# EAGLE design BLEduino_Shield-Shield (EAGLE 6.5.0)
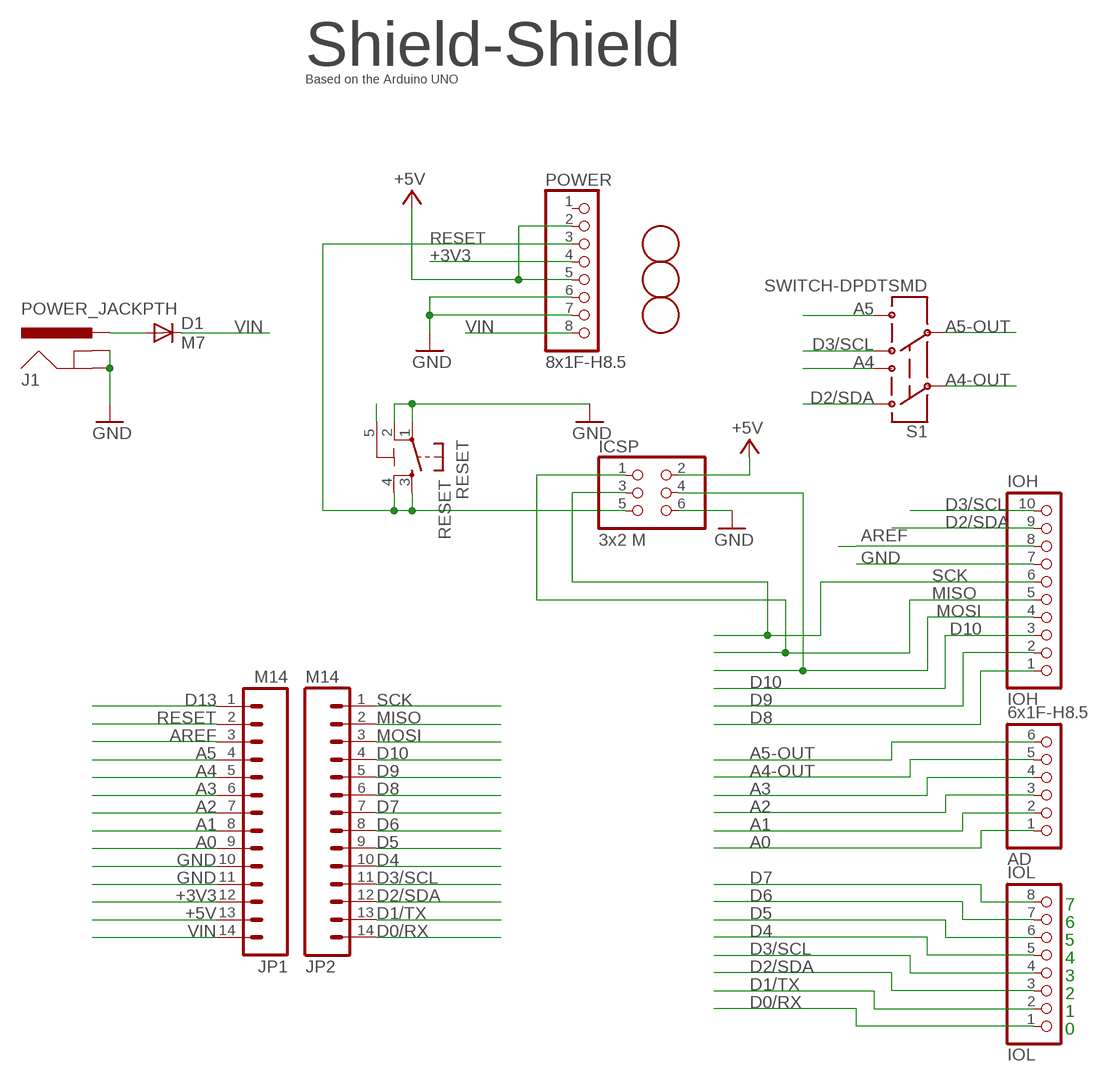
[diagram p0: schematic, sheet 1]

## Parts
AD  6x1F-H8.5  PINHD-1X6  [1X06]
D1  M7  DIODE-SMB  [SMB]
FD1  FIDUCIALMOUNT  [FIDUCIA-MOUNT]
FD2  FIDUCIALMOUNT  [FIDUCIA-MOUNT]
FD3  FIDUCIALMOUNT  [FIDUCIA-MOUNT]
ICSP  3x2 M  PINHD-2X3  [2X03]
IOH  IOH  PINHD-1X10_ARD  [1X10]
IOL  IOL  PINHD-1X8  [1X08]
J1  POWER_JACKPTH  [POWER_JACK_PTH]
JP1  M14  [1X14]
JP2  M14  [1X14]
POWER  8x1F-H8.5  PINHD-1X8  [1X08]
RESET  RESET  TS42  [TS42]
S1  SWITCH-DPDTSMD  [AYZ0202]

## Nets
+3V3: JP1.12 POWER.4
+5V: ICSP.2 JP1.13 POWER.2 POWER.5
A0: AD.1 JP1.9
A1: AD.2 JP1.8
A2: AD.3 JP1.7
A3: AD.4 JP1.6
A4: JP1.5 S1.3
A4-OUT: AD.5 S1.2
A5: JP1.4 S1.6
A5-OUT: AD.6 S1.5
AREF: IOH.8 JP1.3
D0/RX: IOL.1 JP2.14
D1/TX: IOL.2 JP2.13
D2/SDA: IOH.9 IOL.3 JP2.12 S1.1
D3/SCL: IOH.10 IOL.4 JP2.11 S1.4
D4: IOL.5 JP2.10
D5: IOL.6 JP2.9
D6: IOL.7 JP2.8
D7: IOL.8 JP2.7
D8: IOH.1 JP2.6
D9: IOH.2 JP2.5
D10: IOH.3 JP2.4
D13: JP1.1
GND: ICSP.6 IOH.7 J1.GND J1.GNDBREAK JP1.10 JP1.11 POWER.6 POWER.7 RESET.1 RESET.2
MISO: ICSP.1 IOH.5 JP2.2
MOSI: ICSP.4 IOH.4 JP2.3
N$2: RESET.5(5-GND)
N$3: D1.A J1.PWR
RESET: ICSP.5 JP1.2 POWER.3 RESET.3 RESET.4
SCK: ICSP.3 IOH.6 JP2.1
VIN [power]: D1.C JP1.14 POWER.8
Unconnected: POWER.1

## Notes on the sheet
- Shield-Shield
- Based on the Arduino UNO
- 7
- 6
- 5
- 4
- 3
- 2
- 1
- 0

## Library data of the parts
AD = SmartPrj:PINHD-1X6: PIN HEADER
D1 = diode:DIODE-: DIODE
FD1-FD3 = SmartPrj:FIDUCIALMOUNT
ICSP = SmartPrj:PINHD-2X3: PIN HEADER
IOH = SmartPrj:PINHD-1X10_ARD: PIN HEADER
IOL POWER = SmartPrj:PINHD-1X8: PIN HEADER
J1 = SparkFun:POWER_JACK: Power Jack This is the standard 5.5mm barrel jack for power. The PTH is the most common, proven, reliable, footprint. All others are experimental. The Slot footprint only works if the mill layer is transmitted to the PCB fab house so be warned. Spark Fun Electronics SKU : PRT-00119. Mating wall wart : TOL-00298 (and others)
JP1 JP2 = SparkFun:M14: Header 14 Standard 14-pin 0.1" header. Use with straight break away headers (SKU : PRT-00116), right angle break away headers (PRT-00553), swiss pins (PRT-00743), machine pins (PRT-00117), and female headers (PRT-00115).
RESET = SmartPrj:TS42: TS42 Dongnan Electronics Tact switch VDC 12V - 50mA
S1 = SparkFun:SWITCH-DPDT: DPDT Version of the COM-00597

## Net classes
0 default: width 0.254 mm, clearance 0.254 mm
1 power: width 0.61 mm, drill 0.61 mm, clearance 0.254 mm
2 gnd: width 0.305 mm, drill 0.559 mm, clearance 0.254 mm
3 usbvcc: width 0.508 mm, drill 0.61 mm, clearance 0.254 mm
4 aref: width 0.406 mm, drill 0.61 mm, clearance 0.254 mm

## Board
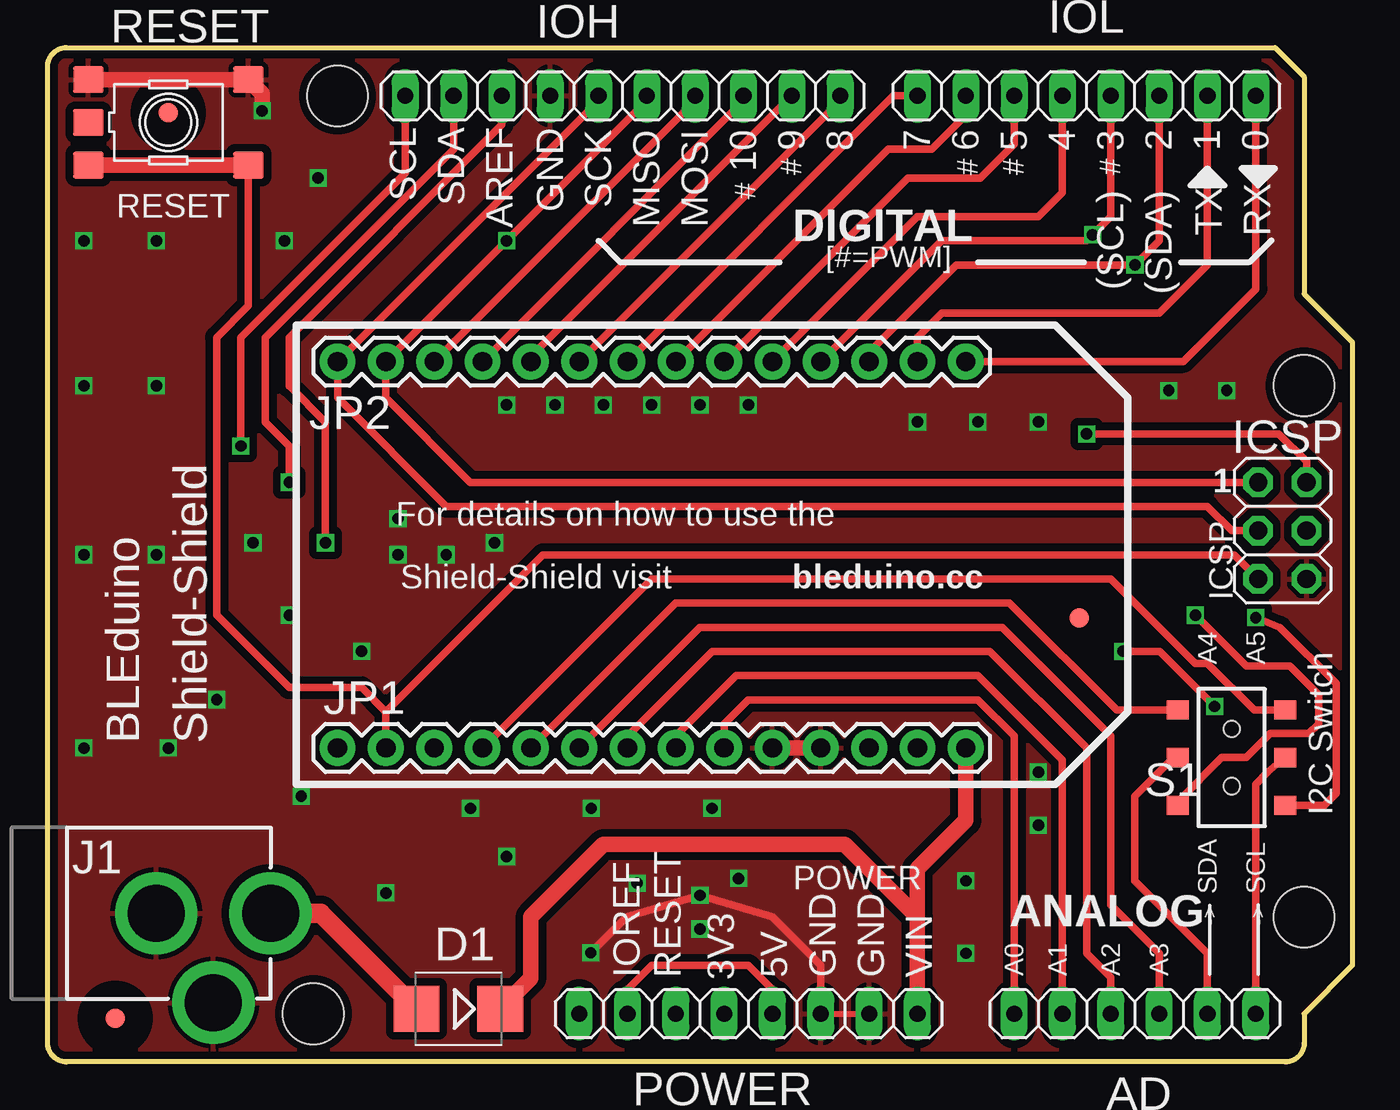
[diagram p1: board, top side]
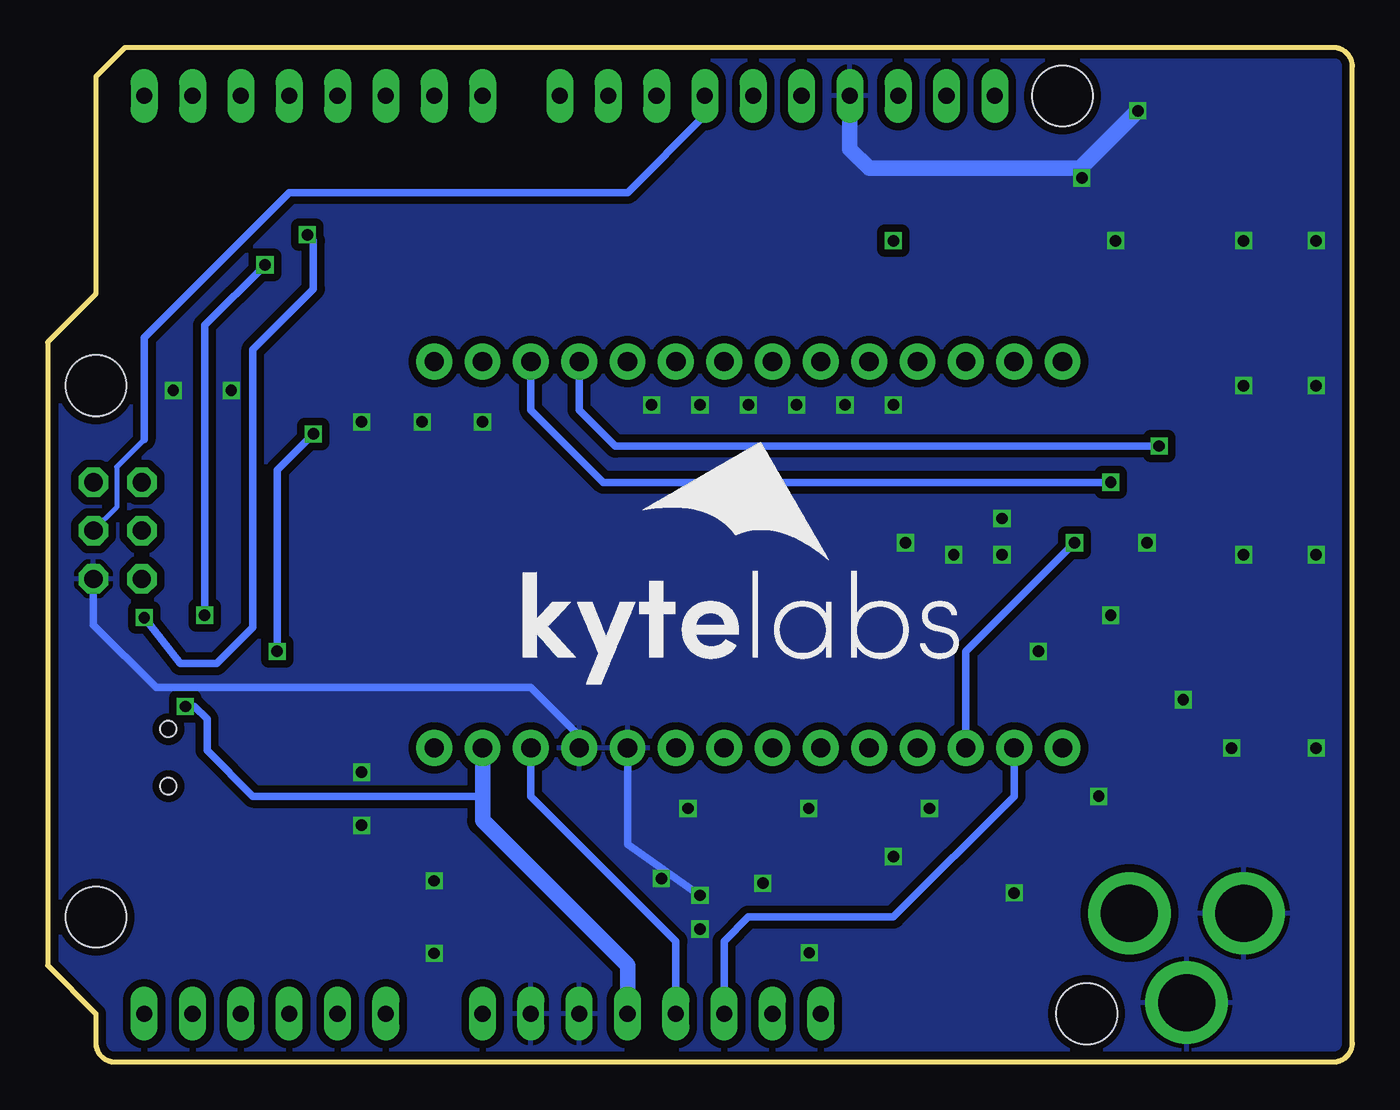
[diagram p2: board, bottom side, seen from below]

Size 68.58 x 53.34 mm. Coordinates in mm from the lower left corner, seen from the top.
Outline: 64.52,53.34 66.04,51.82 66.04,40.39 68.58,37.85 68.58,5.08 66.04,2.54 66.04,1 arc-90 65.04,0 1,0 arc-90 0,1 0,52.34 arc-90 1,53.34 64.52,53.34
Copper layers (1*2*15*16): Top 0.035mm / dielectric 0.2mm / Route2 0.0175mm / dielectric 1.1mm / Route15 0.0175mm / dielectric 0.2mm / Bottom 0.035mm
Design rules "SeeedStudio_DRU_no_angle_20130527": minimum track width 6mil, minimum drill 12mil, track to track 6mil, track to pad 6mil, pad to pad 6mil, via to via 6mil, smd to smd 0mil, copper to edge 10mil, drill to drill 10mil, minimum pad ring 6mil, minimum via ring 6mil, stop-mask expansion 2mil, vias tented up to drill 25mil, thermal gap 10mil
Holes 3.2 mm at 66.04,35.56 66.04,7.62 15.24,50.8 13.97,2.54
vRestrict: area 22.9,44.1 to 24.6,49.1; area 25.4,45.5 to 27.1,49.1; area 28.4,45.3 to 29.6,48.8; area 31,45.3 to 32.1,48.8; area 33.5,45.3 to 34.7,48.8; area 36.1,45.3 to 37.2,48.8; area 38.7,47.2 to 39.9,48.8; area 40.3,45.1 to 47.6,46.9; area 60.3,44.2 to 61.7,46.7; area 62.9,44.2 to 64.3,46.7; area 61.3,35.8 to 64.8,37.2; area 0.6,21.8 to 2,30.1; 14 more areas

### Footprints (pad centres in the part's own frame; a part is rotated, then mirrored left to right if it is on the bottom)
1X06 = drill 0.85 pad 1.422 long: 1 -6.35,0; 2 -3.81,0; 3 -1.27,0; 4 1.27,0; 5 3.81,0; 6 6.35,0
SMB = smd 2.4 x 2.4: A 2.2,0; C -2.2,0
FIDUCIA-MOUNT = smd 1.016 x 1.016: P$1 0,0
2X03 = drill 0.95 pad 1.55 octagon: 1 -2.54,-1.27; 2 -2.54,1.27; 3 0,-1.27; 4 0,1.27; 5 2.54,-1.27; 6 2.54,1.27
1X10@1 = drill 0.85 pad 1.422 long: 1 -11.43,0; 2 -8.89,0; 3 -6.35,0; 4 -3.81,0; 5 -1.27,0; 6 1.27,0; 7 3.81,0; 8 6.35,0; 9 8.89,0; 10 11.43,0
1X08 = drill 0.85 pad 1.422 long: 1 -8.89,0; 2 -6.35,0; 3 -3.81,0; 4 -1.27,0; 5 1.27,0; 6 3.81,0; 7 6.35,0; 8 8.89,0
POWER_JACK_PTH = drill 2.997 pad 4.318: GND 0,7.7; GNDBREAK 4.7,10.7; PWR 0,13.7
1X14 = drill 1.016 pad 1.88: 1 0,0; 2 2.54,0; 3 5.08,0; 4 7.62,0; 5 10.16,0; 6 12.7,0; 7 15.24,0; 8 17.78,0; 9 20.32,0; 10 22.86,0; 11 25.4,0; 12 27.94,0; 13 30.48,0; 14 33.02,0
TS42 = smd 1.6 x 1.4: 1 -4.2,2.25; 2 4.2,2.25; 3 -4.2,-2.25; 4 4.2,-2.25; 5 -4.2,0
AYZ0202 = smd 1 x 1.15: 1 -2.5,2.825; 2 0,2.825; 3 2.5,2.825; 4 -2.5,-2.825; 5 0,-2.825; 6 2.5,-2.825 | hole 0.85: 1.5,0; -1.5,0

### Placement (x,y rotation side)
AD  57.15,2.54 0 top
D1  21.59,2.79 180 top
FD1  6.35,49.91 0 top
FD2  54.22,23.34 0 top
FD3  3.56,2.29 0 top
ICSP  64.9,27.94 270 top
IOH  IOH  [1X10@1]  30.23,50.8 180 top
IOL  54.61,50.8 180 top
J1  -1.98,7.82 270 top
JP1  15.24,16.51 0 top
JP2  15.24,36.83 0 top
POWER  36.83,2.54 0 top
RESET  6.35,49.4 0 top
S1  62.23,16 90 top
U$1  [KYTELABS_LOGO_BIG]  43.81,20.95 0 bottom

### Tracks (layer width: path | path; a pad name or v marks a point on that pad's centre or on a via)
+3V3
  Bottom 0.406: POWER.4 35.56,6.35 43.18,13.97 JP1.12
+5V  (via drill 0.6)
  Top 0.406: POWER.2 30.48,3.81 31.75,5.08 36.83,5.08 38.1,3.81 POWER.5 | ICSP.2 66.17,31.57 64.72,33.02 v54.61,33.02 | v56.52,21.59 58.45,21.59 v61.34,18.69
  Bottom 0.406: v54.61,33.02 56.52,31.11 v56.52,21.59 | 45.72,13.97 57.78,13.97 60.2,16.38 60.2,18.03 60.86,18.69 v61.34,18.69
  Bottom 0.813: JP1.13 45.72,13.97 45.72,12.7 38.1,5.08 POWER.5
A0
  Top 0.406: JP1.9 35.56,17.78 36.83,19.05 48.9,19.05 50.8,17.14 AD.1
A1
  Top 0.406: JP1.8 33.02,17.14 36.2,20.32 48.9,20.32 53.34,15.88 AD.2
A2
  Top 0.406: JP1.7 30.48,17.14 34.92,21.59 49.53,21.59 54.61,16.51 54.61,5.71 55.88,4.45 AD.3
A3
  Top 0.406: JP1.6 34.29,22.86 50.16,22.86 55.88,17.14 55.88,8.26 58.42,5.71 AD.4
A4
  Top 0.406: JP1.5 33.02,24.13 50.55,24.13 56.18,18.5 S1.3
A4-OUT
  Top 0.406: AD.5 60.96,5.71 57.15,9.53 57.15,13.97 59.18,16 S1.2
A5
  Top 0.406: JP1.4 31.75,25.4 55.88,25.4 60.33,20.95 60.96,20.95 63.41,18.5 S1.6
A5-OUT
  Top 0.406: AD.6 63.5,14.61 64.14,15.24 S1.5
AREF  (via drill 0.6)
  Top 0.406: v14.61,27.3 14.61,33.66 12.72,35.53 12.7,35.53 12.7,38.1 23.88,49.28 IOH.8
  Bottom 0.406: v14.61,27.3 20.32,21.59 JP1.3
D0/RX
  Top 0.406: JP2.14 59.69,36.83 63.5,40.64 IOL.1
D1/TX
  Top 0.406: JP2.13 45.72,38.1 46.99,39.37 58.42,39.37 60.96,41.91 IOL.2
D2/SDA  (via drill 0.6)
  Top 0.406: IOL.3 58.42,43.18 v57.15,41.91 47.75,41.91 43.18,37.34 JP2.12 | v12.7,30.48 12.7,32.38 11.43,33.66 11.43,38.1 21.34,48.01 IOH.9 | v60.33,23.5 62.99,20.83 65.28,20.83 66.8,19.3 66.8,17.78 66.29,17.27 64.26,17.27 62.99,16 61.72,16 59.41,13.69 S1.1
  Bottom 0.406: v12.7,30.48 39.37,30.48 43.18,34.29 JP2.12 | v60.33,23.5 60.33,38.73 v57.15,41.91
D3/SCL  (via drill 0.6)
  Top 0.406: JP2.11 46.99,43.18 54.61,43.18 v54.93,43.5 55.88,44.45 IOL.4 | IOH.10 18.8,46.74 10.16,38.1 v10.16,32.38 | v63.5,23.37 64.77,22.86 67.72,19.91 67.72,14.12 67.1,13.5 S1.4
  Bottom 0.406: v10.16,32.38 38.73,32.38 40.64,34.29 JP2.11 | v63.5,23.37 61.59,20.95 59.69,20.95 57.78,22.86 57.78,37.47 54.61,40.64 54.61,43.18 v54.93,43.5
D4
  Top 0.406: IOL.5 53.34,45.72 52.07,44.45 45.72,44.45 JP2.10
D5
  Top 0.406: JP2.9 45.21,46.48 49.02,46.48 50.8,48.26 IOL.6
D6
  Top 0.406: IOL.7 48.26,49.78 46.48,48.01 44.2,48.01 JP2.8
D7
  Top 0.406: JP2.7 44.45,50.8 IOL.8
D8
  Top 0.406: JP2.6 41.66,50.55 IOH.1
D9
  Top 0.406: IOH.2 25.4,37.08 JP2.5
D10
  Top 0.406: JP2.4 36.58,50.55 IOH.3
GND  (via drill 0.6)
  Top 0.305: POWER.6 POWER.7
  Top 0.406: POWER.6 40.64,5.08 38.1,7.62 v34.29,8.76 30.43,7.62 v28.55,5.74
  Top 0.813: J1.GND 5.72,6.12 | RESET.1 RESET.2 11.28,50.92 v11.28,50.01 | JP1.11 JP1.10
  Bottom 0.406: JP1.10 38.1,11.43 v34.29,8.76 | ICSP.6 66.17,22.99 62.87,19.68 43.18,19.68 40.64,17.14 JP1.11
  Bottom 0.813: v11.28,50.01 14.3,46.99 25.4,46.99 26.42,48.01 IOH.7
  other vias: 1.91,43.18 5.71,43.18 1.91,35.56 5.71,35.56 1.91,26.67 1.91,16.51 6.35,16.51 5.71,26.67 8.89,19.05 13.34,13.97 17.78,8.89 22.23,13.34 24.13,10.79 28.57,13.34 34.92,13.34 34.29,6.99 20.95,26.67 12.7,23.5 10.79,27.3 16.51,21.59 18.41,26.67 18.41,28.57 23.5,27.3 45.72,33.66 48.9,33.66 52.07,33.66 48.26,9.53 48.26,5.71 58.93,35.31 61.98,35.31 24.13,34.54 26.67,34.54 29.21,34.54 31.75,34.54 34.29,34.54 36.83,34.54 30.99,9.4 36.32,9.65 12.45,43.18 14.22,46.48 52.07,15.24 52.07,12.45
  pour Bottom (isolate 0.406, rank 2): 0.64,52.7 67.69,52.7 67.94,52.45 67.94,0.64 0.89,0.64 0.64,0.89
  pour Top (isolate 0.406, rank 2): 0.64,52.7 67.94,52.7 67.94,0.64 0.64,0.64 0.51,30.48 0.64,30.48
MISO  (via drill 0.6)
  Top 0.406: ICSP.1 22.23,30.48 17.78,34.92 JP2.2 v24.13,43.18 31.5,50.55 IOH.5
MOSI
  Top 0.406: JP2.3 34.04,50.55 IOH.4
  Bottom 0.254: 63.5,32.74 64.95,31.29 64.95,29.16 ICSP.4
  Bottom 0.406: 63.5,32.74 63.5,38.1 55.88,45.72 38.1,45.72 34.04,49.78 IOH.4
N$3
  Top 1.016: J1.PWR 14.36,7.82 D1.A
RESET
  Top 0.406: RESET.4 10.55,39.76 8.89,38.1 8.89,23.5 12.7,19.68 16.51,19.68 17.78,18.41 | 17.78,18.41 JP1.2 | 17.78,18.41 26.04,26.67 62.36,26.67 ICSP.5
  Top 0.813: RESET.3 RESET.4
  Bottom 0.406: POWER.3 33.02,6.35 31.75,7.62 24.13,7.62 17.78,13.97 JP1.2
SCK
  Top 0.406: IOH.6 28.96,50.55 JP2.1 15.24,34.92 20.95,29.21 60.96,29.21 62.23,27.94 ICSP.3
VIN
  Top 0.813: JP1.14 48.26,12.7 45.72,10.16 POWER.8 45.72,7.62 43.31,10.03 43.18,10.16 41.91,11.43 29.21,11.43 25.4,7.62 25.4,4.4 D1.C

### Text on the board
tPlace: SCL | SDA | AREF | GND | SCK | MISO | MOSI | 10 | 9 | 8 | 7 | 6 | 5 | 4 | 3 | 2 | 1 | 0 | # | # | # | # | (SCL) | (SDA) | # | DIGITAL | TX | RX | [#=PWM] | 1 | For details on how to use the | Shield-Shield visit | bleduino.cc | I2C Switch | A4 | A5 | BLEduino | Shield-Shield | SDA | SCL | ANALOG | -> | -> | A0 | A1 | A2 | A3 | IOREF | RESET | 3V3 | 5V | GND | GND | VIN
tNames: RESET | IOH | IOL | JP2 | ICSP | JP1 | S1 | J1 | D1 | POWER | AD
Document: IOH | IOL | JP2 | JP1 | J1 | POWER | AD
ReferenceLC: L | TX | ON | RX | PC1 | PC2
214bmp: D:/SmartProjects/Snc/a4_bn_logo2.bmp